# Altium project Shadowfang_Proj.PrjPcb
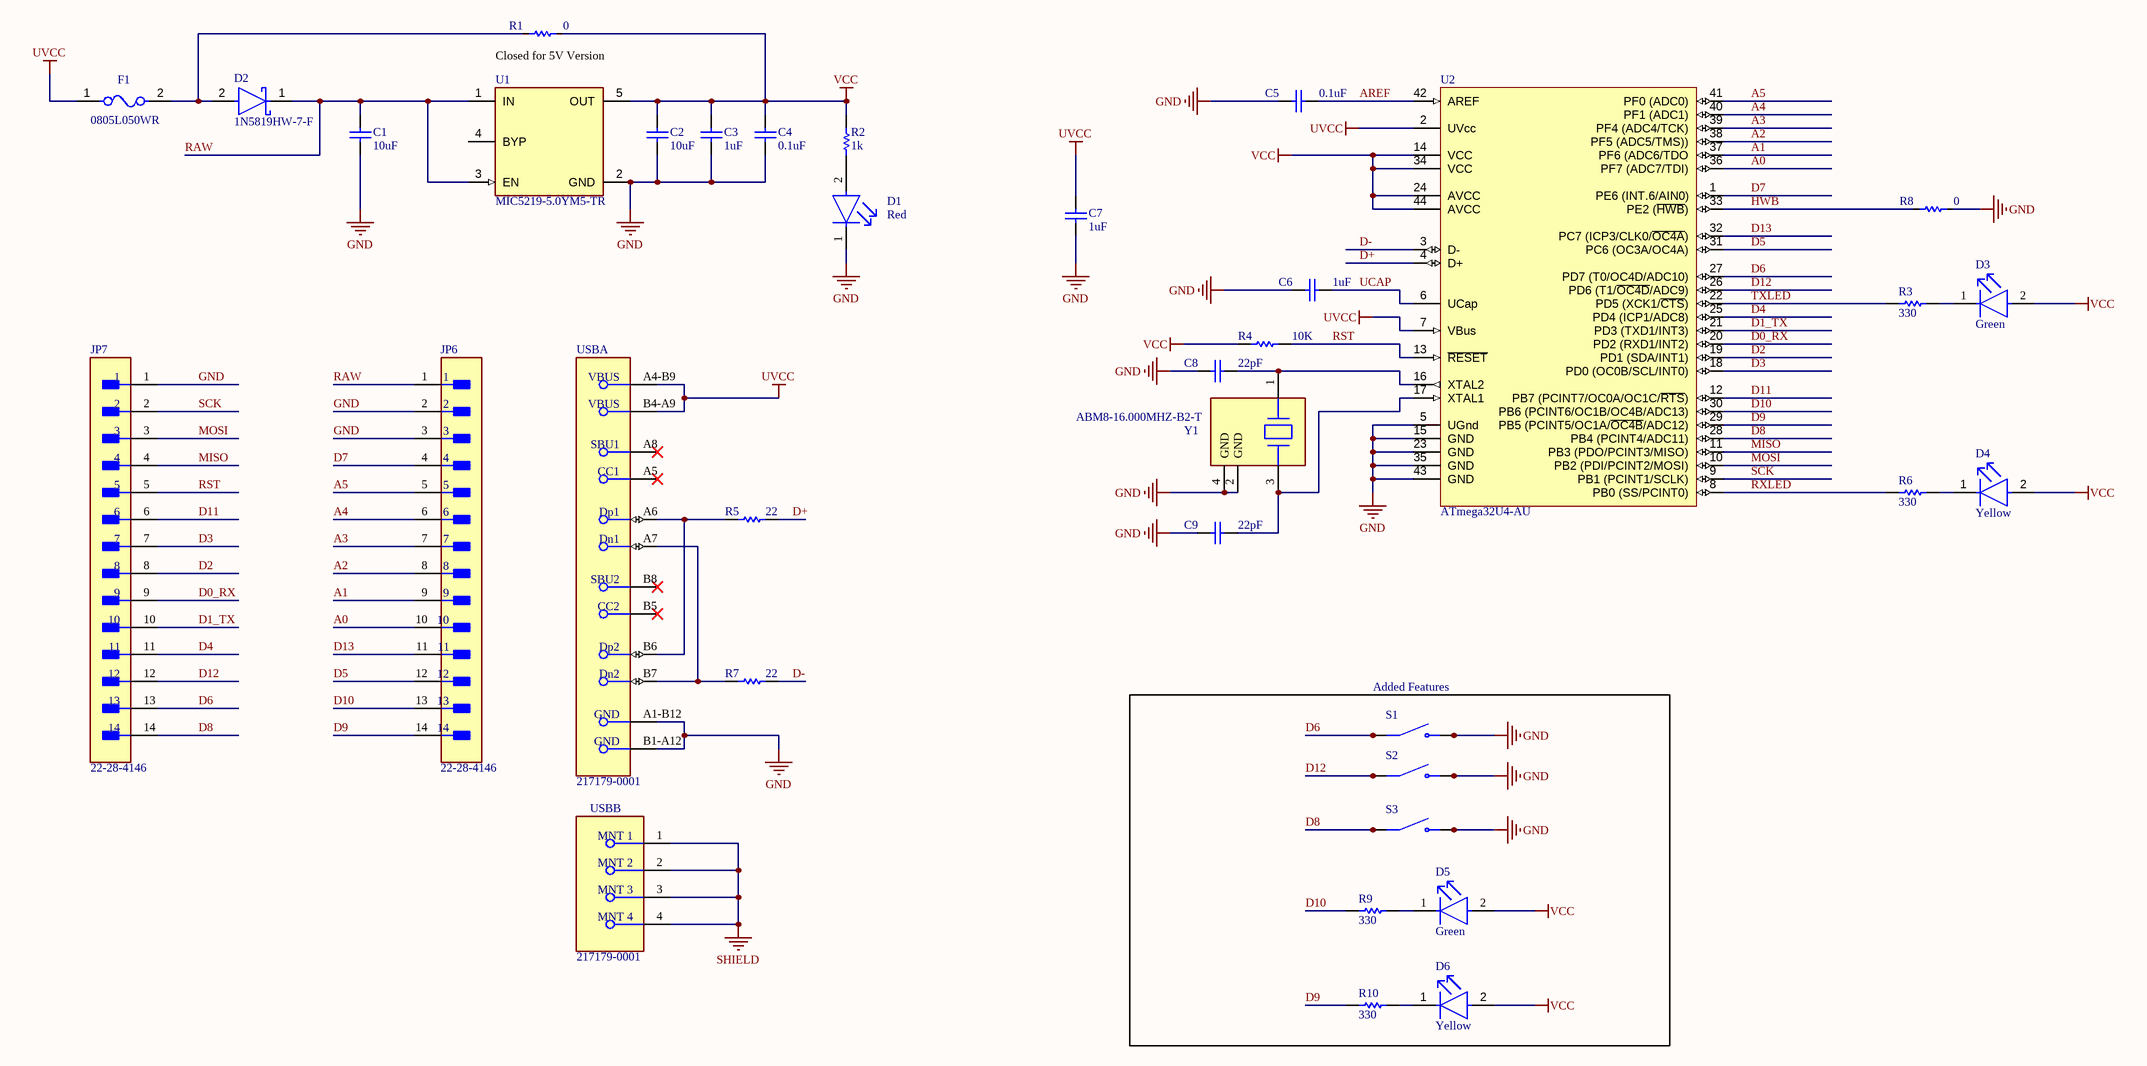
[diagram p0: ATMega32U4.SchDoc]
1 sheet, 35 parts. Net scope: global (net labels, ports and power ports of the same name join across sheets).
Board files: PCB1.PcbDoc, PCB_PANEL.PcbDoc

## Sheet ATMega32U4.SchDoc
size 863 x 558 mm; SheetNumber: 1; SheetTotal: 1

### Parts
C1  Capacitance: 10uF  [CAPC1608X09L]  (hidden comment: CAP GENERIC 0603)
C2  Capacitance: 10uF  [CAPC1608X09L]  (hidden comment: CAP GENERIC 0603)
C3  Capacitance: 1uF  [CAPC1608X09L]  (hidden comment: CAP GENERIC 0603)
C4  Capacitance: 0.1uF  [CAPC1608X09L]  (hidden comment: CAP GENERIC 0603)
C5  Capacitance: 0.1uF  [CAPC1608X09L]  (hidden comment: CAP GENERIC 0603)
C6  Capacitance: 1uF  [CAPC1608X09L]  (hidden comment: CAP GENERIC 0603)
C7  Capacitance: 1uF  [CAPC1608X09L]  (hidden comment: CAP GENERIC 0603)
C8  Capacitance: 22pF  [CAPC1608X09L]  (hidden comment: CAP GENERIC 0603)
C9  Capacitance: 22pF  [CAPC1608X09L]  (hidden comment: CAP GENERIC 0603)
D1  Red  [FP-LTST-C191KRKT-MFG]
D2  1N5819HW-7-F  [FP-SOD123-IPC_A]
D3  Green  [FP-LTST-C191KGKT-MFG]
D4  Yellow  [FP-LTST-C191KSKT-MFG]
D5  Green  [FP-LTST-C191KGKT-MFG]
D6  Yellow  [FP-LTST-C191KSKT-MFG]
F1  0805L050WR  [FP-0805L-MFG]
JP6  22-28-4146  [FP-22-28-4146-MFG]
JP7  22-28-4146  [FP-22-28-4146-MFG]
R1  0  [RES_0603]
R2  Resistance (Ohms): 1k  [RESC1608X06L]  (hidden comment: GENERIC 0603 RESISTOR)
R3  Resistance (Ohms): 330  [RESC1608X06L]  (hidden comment: GENERIC 0603 RESISTOR)
R4  Resistance (Ohms): 10K  [RESC1608X06L]  (hidden comment: GENERIC 0603 RESISTOR)
R5  Resistance (Ohms): 22  [RESC1608X06L]  (hidden comment: GENERIC 0603 RESISTOR)
R6  Resistance (Ohms): 330  [RESC1608X06L]  (hidden comment: GENERIC 0603 RESISTOR)
R7  Resistance (Ohms): 22  [RESC1608X06L]  (hidden comment: GENERIC 0603 RESISTOR)
R8  0  [RES_0603]
R9  Resistance (Ohms): 330  [RESC1608X06L]  (hidden comment: GENERIC 0603 RESISTOR)
R10  Resistance (Ohms): 330  [RESC1608X06L]  (hidden comment: GENERIC 0603 RESISTOR)
S1  PTS_647_SN50_SMTR2_LFS  [SW_PTS_647_SN50_SMTR2_LFS]  (value not drawn)
S2  PTS_647_SN50_SMTR2_LFS  [SW_PTS_647_SN50_SMTR2_LFS]  (value not drawn)
S3  PTS_647_SN50_SMTR2_LFS  [SW_PTS_647_SN50_SMTR2_LFS]  (value not drawn)
U1  MIC5219-5.0YM5-TR  [FP-SOT23-5LD-PL-1-MFG]
U2  ATmega32U4-AU  [44ML_M]
USB  217179-0001  [FP-2171790001-MFG]  (parts A,B of 2)
Y1  ABM8-16.000MHZ-B2-T  [FP-ABM8-MFG]

### Blocks framed on the sheet
Added Features: D5 D6 R9 R10 S1-S3

### Nets
GND: C1.1 C2.1 C3.1 C4.1 C5.1 C6.1 C7.1 C8.1 C9.1 D1.1(C) JP6.2 JP6.3 JP7.1 R8.2 S1.1(NO) S1.2(NO) S2.1(NO) S2.2(NO) S3.1(NO) S3.2(NO) U1.2(GND) U2.5(UGnd) U2.15(GND) U2.23(GND) U2.35(GND) U2.43(GND) USB.A1-B12(GND) USB.B1-A12(GND) Y1.2(GND) Y1.4(GND)
SHIELD: USB.1(MNT_1) USB.2(MNT_2) USB.3(MNT_3) USB.4(MNT_4)
UVCC: C7.2 F1.1 U2.2(UVcc) U2.7(VBus) USB.A4-B9(VBUS) USB.B4-A9(VBUS)
VCC: C2.2 C3.2 C4.2 D3.2(A) D4.2(A) D5.2(A) D6.2(A) R1.2 R2.2 R4.1 U1.5(OUT) U2.14(VCC) U2.24(AVCC) U2.34(VCC) U2.44(AVCC)
A0: JP6.10 U2.36(PF7_(ADC7/TDI))
A1: JP6.9 U2.37(PF6_(ADC6/TDO)
A2: JP6.8 U2.38(PF5_(ADC5/TMS)))
A3: JP6.7 U2.39(PF4_(ADC4/TCK))
A4: JP6.6 U2.40(PF1_(ADC1))
A5: JP6.5 U2.41(PF0_(ADC0))
AREF: C5.2 U2.42(AREF)
D0_RX: JP7.9 U2.20(PD2_(RXD1/INT2))
D1_TX: JP7.10 U2.21(PD3_(TXD1/INT3))
D2: JP7.8 U2.19(PD1_(SDA/INT1))
D3: JP7.7 U2.18(PD0_(OC0B/SCL/INT0))
D4: JP7.11 U2.25(PD4_(ICP1/ADC8))
D5: JP6.12 U2.31(PC6_(OC3A/OC4A))
D6: JP7.13 S1.3(COM) S1.4(COM) U2.27(PD7_(T0/OC4D/ADC10))
D7: JP6.4 U2.1(PE6_(INT.6/AIN0))
D8: JP7.14 S3.3(COM) S3.4(COM) U2.28(PB4_(PCINT4/ADC11))
D9: JP6.14 R10.1 U2.29(PB5_(PCINT5/OC1A/~{OC4B}/ADC12))
D10: JP6.13 R9.1 U2.30(PB6_(PCINT6/OC1B/OC4B/ADC13))
D11: JP7.6 U2.12(PB7_(PCINT7/OC0A/OC1C/~{RTS}))
D12: JP7.12 S2.3(COM) S2.4(COM) U2.26(PD6_(T1/~{OC4D}/ADC9))
D13: JP6.11 U2.32(PC7_(ICP3/CLK0/~{OC4A}))
D+: R5.2 U2.4(D+)
D-: R7.2 U2.3(D-)
HWB: R8.1 U2.33(PE2_(~{HWB}))
MISO: JP7.4 U2.11(PB3_(PDO/PCINT3/MISO))
MOSI: JP7.3 U2.10(PB2_(PDI/PCINT2/MOSI))
RAW: C1.2 D2.1(C) JP6.1 U1.1(IN) U1.3(EN)
RST: JP7.5 R4.2 U2.13(~{RESET})
RXLED: R6.1 U2.8(PB0_(SS/PCINT0))
SCK: JP7.2 U2.9(PB1_(PCINT1/SCLK))
TXLED: R3.1 U2.22(PD5_(XCK1/~{CTS}))
UCAP: C6.2 U2.6(UCap)
NetC8_2: C8.2 U2.16(XTAL2) Y1.1
NetC9_2: C9.2 U2.17(XTAL1) Y1.3
NetD1_2: D1.2(A) R2.1
NetD2_2: D2.2(A) F1.2 R1.1
NetD3_1: D3.1(C) R3.2
NetD4_1: D4.1(C) R6.2
NetD5_1: D5.1(C) R9.2
NetD6_1: D6.1(C) R10.2
NetR5_1: R5.1 USB.A6(Dp1) USB.B6(Dp2)
NetR7_1: R7.1 USB.A7(Dn1) USB.B7(Dn2)

Not connected (* = marked no-connect by the designer): U1 4(BYP); USB A5(CC1)* A8(SBU1)* B5(CC2)* B8(SBU2)*

### Notes on the sheet
- (near R1) Closed for 5V Version
- DWG. NO.
- REV.
- SHT.
- REVISION
- DESCRIPTION
- DATE
- APPROVED
- THIS DOCUMENT AND THE DATA DISCLOSED HEREIN OR HEREWITH IS THE PROPERTY OF ALTIUM LIMITED AND MAY BE FREELY DISTRIBUTED IN WHOLE. NO RIGHTS ARE RESERVED OR EXPRESS OR IMPLIED WARANTEE GIVEN.
- ENG:
- DSN:
- APPROVALS
- PROJECT
- DOCUMENT REVISION:
- DESIGN ITEM:
- CHK:
- BOM:
- REFERENCE DOCUMENTS
- PROJECT REVISION:
- TITLE
- FAB DWG:
- PCB DWG:
- ASSY DWG:
- SCALE:
- SIZE
- D
- CAGE CODE
- FILE NAME
- DWG NO.
- SHEET
- OF
- REV

### Library data of the parts
C1 C2 = CAP0603: Manufacturer Part Number: GRM188R61C106MAALD; Tolerance: *; Voltage (Rated): *; Temperature Coefficient: *; Ratings: *; Operating Temperature: *
C3 C6 C7 = CAP0603: Manufacturer Part Number: GCM188R71E105KA64D; Tolerance: *; Voltage (Rated): *; Temperature Coefficient: *; Ratings: *; Operating Temperature: *
C4 C5 = CAP0603: Manufacturer Part Number: GCM188R71H104KA57D; Tolerance: *; Voltage (Rated): *; Temperature Coefficient: *; Ratings: *; Operating Temperature: *
C8 C9 = CAP0603: Manufacturer Part Number: GCM1885C2A220FA16D; Tolerance: *; Voltage (Rated): *; Temperature Coefficient: *; Ratings: *; Operating Temperature: *
D1 = CMP-2000-05199-2: NexarPartId: 549908; Manufacturer: Vishay Lite-On; Manufacturer Part Number: LTST-C191KRKT; Lens Transparency: Clear; Luminous Intensity: 54mcd; Current: 2A; Forward Current: 20mA; Number of Elements: 1; Power Rating: 75mW; Lens Color: Colorless; Wavelength: 639nm; Viewing Angle: 130°; Voltage: 2V; Dominant Wavelength: 631nm; Reverse Voltage: 5V; Shape: Rectangular; Optoelectronic Device Type: SINGLE COLOR LED; Overall Height: 0.55mm; Illumination Color: Red; Height: 550µm; Length: 1.6mm; Number of Pins: 2; Packaging: Tape and Reel; Mount: Surface Mount; Case Code (Metric): 1608; Radiation Hardening: No; Case Code (Imperial): 0603; Test Current: 20mA; Number of LEDs: 1; Schedule B: 8541402000, 8541402000; Lead Free: Lead Free; Power Dissipation: 75mW; RoHS: Compliant; Forward Voltage: 2V; Lens Style: Clear; Color: Red; Max Operating Temperature: 85°C; Depth: 800µm; Width: 800µm; Min Operating Temperature: -55°C; Case/Package: 0603; Supplier: Digikey; Supplier Part Number: 160-1447-1-ND; Category: LEDs; Stock: 867088; Pricing: 1=0.15, 10=0.1, 100=0.0687, 500=0.05446, 1000=0.0497, 2000=0.04563, 5000=0.04114, 10000=0.03833, 15000=0.03689, 25000=0.03525, 35000=0.03428, 50000=0.03333, 125000=0.03123, 250000=0.02992 (USD); Mounting Technology: Surface Mount; Pins: 2; Color@wavelength: Red; Terminal Finish: Tin; JESD-609 Code: e3; Luminous Intensity-Nom: 54mcd; Channels: 1; Reverse Voltage-Max: 5V; Size: 1.1mm; Terminal Pitch: 1.5mm; Reach SVHC Compliant: Yes; RoHS Compliant: Yes; ComponentLink1URL: https://datasheet.ciiva.com:443/pdfs/VipMasterIC/IC/LITE/LITE-S-A0003156012/LITE-S-A0003156012-1.pdf?src-supplier=IHS+Markit; ComponentLink1Description: https://datasheet.ciiva.com:443/pdfs/VipMasterIC/IC/LITE/LITE-S-A0003156012/LITE-S-A0003156012-1.pdf?src-supplier=IHS+Markit; ComponentLink2URL: https://datasheet.ciiva.com/16212/ltst-c191krkt-16212419.pdf?src-supplier=Future+Electronics; ComponentLink2Description: https://datasheet.ciiva.com/16212/ltst-c191krkt-16212419.pdf?src-supplier=Future+Electronics; ComponentLink3URL: https://datasheet.ciiva.com/12400/lite-on-ltst-c191krkt-190135-12400910.pdf?src-supplier=Mouser; ComponentLink3Description: https://datasheet.ciiva.com/12400/lite-on-ltst-c191krkt-190135-12400910.pdf?src-supplier=Mouser; ComponentLink4URL: https://datasheet.ciiva.com/11773/0900766b80dc02b2-11773601.pdf?src-supplier=Rs; ComponentLink4Description: https://datasheet.ciiva.com/11773/0900766b80dc02b2-11773601.pdf?src-supplier=Rs; ComponentLink5URL: https://datasheet.ciiva.com/15117/getdatasheetpartid-141922-15117737.pdf?src-supplier=Verical; ComponentLink5Description: https://datasheet.ciiva.com/15117/getdatasheetpartid-141922-15117737.pdf?src-supplier=Verical; ComponentLink6URL: https://datasheet.ciiva.com/2109/s-110-ltst-c191krkt-2109970.pdf?src-supplier=Digikey; ComponentLink6Description: https://datasheet.ciiva.com/2109/s-110-ltst-c191krkt-2109970.pdf?src-supplier=Digikey; ComponentLink7URL: https://datasheet.ciiva.com/2109/s-110-ltst-c191krkt-2109971.pdf?src-supplier=Digikey; ComponentLink7Description: https://datasheet.ciiva.com/2109/s-110-ltst-c191krkt-2109971.pdf?src-supplier=Digikey; ComponentLink8URL: https://datasheet.ciiva.com/2109/s-110-ltst-c191krkt-2109972.pdf?src-supplier=Digikey; ComponentLink8Description: https://datasheet.ciiva.com/2109/s-110-ltst-c191krkt-2109972.pdf?src-supplier=Digikey
D2 = CMP-0303-00003-3: DIODE SCHOTTKY 40V 1A SOD123; Manufacturer: Diodes; Forward Voltage: 450mV; Capacitance: 110pF; Max Forward Surge Current (Ifsm): 25A; Peak Reverse Current: 50uA; Polarity: Standard; Element Configuration: Single; Max Power Dissipation: 450mW; Diode Element Material: SILICON; Package Body Material: Plastic; Diode Type: RECTIFIER; Number of Elements: 1; Time @ Peak Reflow Temperature-Max (s): 40s; Qualification Status: Not Qualified; Min Operating Temperature: -65°C; Package Quantity: 3000; Contact Plating: Tin; Weight: 0.000353oz; Max Repetitive Reverse Voltage (Vrrm): 40V; Max Reverse Voltage (DC): 40V; Height: 1.25mm; Average Rectified Current: 1A; Width: 1.7mm; Case/Package: SOD-123-2; Lead Free: Lead Free; Max Operating Temperature: 125°C; Current Rating: 1A; Termination: SMD/SMT; Forward Current: 1A; Radiation Hardening: No; Number of Pins: 2; Length: 2.85mm; Voltage Rating (DC): 40V; REACH SVHC: No SVHC; Peak Non-Repetitive Surge Current: 25A; Packaging: Tape and Reel; Output Current: 1A; Supplier: Digikey; Supplier Part Number: 1N5819HW-FDICT-ND; Manufacturer Part Number: 1N5819HW-7-F; RoHS: Yes; Category: Schottky Diodes; Stock: 233752; Pricing: 1=0.23, 10=0.143, 100=0.1103, 500=0.09626, 1000=0.08516, 3000=0.05656, 6000=0.0532, 9000=0.05304, 15000=0.03424 (USD); Pins: 2; Package Shape: Rectangular; Terminal Finish: Tin; Non-rep Pk Forward Current-Max: 25A; Max Output current: 1A; Package Style: SMALL OUTLINEMeter; Rep Pk Reverse Voltage-Max: 40V; Surface Mount: Yes; Terminal Form: Gull Wing; Terminal Position: DUAL; JESD-609 Code: e3; JESD-30 Code: R-PDSO-G2; Peak Reflow Temperature (Cel): 260°C; Moisture Sensitivity Level: 1; Technology: SCHOTTKY; Reach SVHC Compliant: Yes; RoHS Compliant: Yes; ComponentLink1URL: https://datasheet.ciiva.com:443/pdfs/VipMasterIC/IC/DIOD/DIOD-S-A0009689747/DIOD-S-A0009691035-1.pdf?src-supplier=IHS+Markit; ComponentLink1Description: https://datasheet.ciiva.com:443/pdfs/VipMasterIC/IC/DIOD/DIOD-S-A0009689747/DIOD-S-A0009691035-1.pdf?src-supplier=IHS+Markit
D3 D5 = CMP-2000-05198-4: LED GREEN CLEAR SMD; NexarPartId: 549907; Manufacturer: Vishay Lite-On; Manufacturer Part Number: LTST-C191KGKT; Forward Voltage: 2V; Viewing Angle: 130°; Power Rating: 75mW; Number of LEDs: 1; Luminous Intensity: 35mcd; Forward Current: 20mA; Dominant Wavelength: 571nm; Lens Color: Clear, Colorless; Reverse Voltage: 5V; Wavelength: 574nm; Shape: Rectangular; Optoelectronic Device Type: SINGLE COLOR LED; Overall Height: 0.55mm; Number of Pins: 2; Lens Transparency: Clear; Packaging: Tape and Reel; Number of Elements: 1; Schedule B: 8541402000, 8541402000; Height: 550µm; Case/Package: 0603; Illumination Color: Green; Depth: 800µm; Max Operating Temperature: 85°C; RoHS: Compliant; Lens Style: Clear; Lead Free: Lead Free; Length: 1.6mm; Mount: Surface Mount; Test Current: 20mA; Width: 800µm; Case Code (Imperial): 0603; Min Operating Temperature: -55°C; Case Code (Metric): 1608; Radiation Hardening: No; Power Dissipation: 75mW; Color: Green; Supplier: Digikey; Supplier Part Number: 160-1446-1-ND; Stock: 1664852; Pricing: 1=0.15, 10=0.1, 100=0.0688, 500=0.05448, 1000=0.04972, 2000=0.04564, 5000=0.04116, 10000=0.03835, 15000=0.0369, 25000=0.03527, 35000=0.03429, 50000=0.03334, 125000=0.03124, 250000=0.02993 (USD); Mounting Technology: Surface Mount; Pins: 2; Color@wavelength: Green; Terminal Finish: Tin; Luminous Intensity-Nom: 35mcd; Channels: 1; JESD-609 Code: e3; Reverse Voltage-Max: 5V; Size: 1.1mm; Terminal Pitch: 1.5mm; Reach SVHC Compliant: Yes; RoHS Compliant: Yes; ComponentLink1URL: https://datasheet.ciiva.com:443/pdfs/VipMasterIC/IC/LITE/LITE-S-A0003156116/LITE-S-A0003156116-1.pdf?src-supplier=IHS+Markit; ComponentLink1Description: https://datasheet.ciiva.com:443/pdfs/VipMasterIC/IC/LITE/LITE-S-A0003156116/LITE-S-A0003156116-1.pdf?src-supplier=IHS+Markit; ComponentLink2URL: https://datasheet.ciiva.com/2109/ltst-c191kgkt-2109973.pdf?src-supplier=Digikey; ComponentLink2Description: https://datasheet.ciiva.com/2109/ltst-c191kgkt-2109973.pdf?src-supplier=Digikey
D4 D6 = CMP-22017-000025-1: LED YELLOW CLEAR SMD; Manufacturer: Vishay Lite-On; Manufacturer Part Number: LTST-C191KSKT; Dominant Wavelength: 597nm; Power Rating: 75mW; Number of LEDs: 1; Lens Style: Diffused; Forward Current: 30mA; Test Current: 20mA; Forward Voltage: 2.4V; Wavelength: 588nm; Viewing Angle: 130°; Lens Color: Colorless; Reverse Voltage: 5V; Luminous Intensity: 180mcd; Shape: Rectangular; Optoelectronic Device Type: SINGLE COLOR LED; Luminous Intensity-Nom: 104mcd; Overall Height: 0.55mm; Case Code (Imperial): 0603; Width: 0.8mm; Power Dissipation: 75mW; Length: 1.6mm; Illumination Color: Yellow; Number of Pins: 2; Case Code (Metric): 1608; Mount: Surface Mount; Number of Elements: 1; Height: 0.55mm; Lens Transparency: Clear; Depth: 0.8mm; Min Operating Temperature: -55°C; Case/Package: 0603; Radiation Hardening: No; Max Operating Temperature: 85°C; Package Quantity: 1; Packaging: Tape and Reel; Lead Free: Lead Free; Color: Yellow; Supplier: Digikey; Supplier Part Number: 160-1448-1-ND; RoHS: Yes; Category: LEDs; Stock: 620459; Pricing: 1=0.15, 10=0.105, 100=0.0723, 500=0.05736, 1000=0.05238, 2000=0.04813, 5000=0.04344, 10000=0.0405, 15000=0.03899, 25000=0.03728, 35000=0.03627, 50000=0.03527, 125000=0.03308, 250000=0.03171 (USD); Mounting Technology: Surface Mount; Pins: 2; Color@wavelength: Yellow; Terminal Finish: Tin; JESD-609 Code: e3; Channels: 1; Reverse Voltage-Max: 5V; Size: 1.1mm; Terminal Pitch: 1.5mm; Reach SVHC Compliant: Yes; RoHS Compliant: Yes; ComponentLink1URL: https://datasheet.ciiva.com:443/pdfs/VipMasterIC/IC/LITE/LITE-S-A0008870965/LITE-S-A0008870965-1.pdf?src-supplier=IHS+Markit; ComponentLink1Description: https://datasheet.ciiva.com:443/pdfs/VipMasterIC/IC/LITE/LITE-S-A0008870965/LITE-S-A0008870965-1.pdf?src-supplier=IHS+Markit; ComponentLink2URL: https://datasheet.ciiva.com/12400/lite-on-ltst-c191kskt-190097-12400797.pdf?src-supplier=Mouser; ComponentLink2Description: https://datasheet.ciiva.com/12400/lite-on-ltst-c191kskt-190097-12400797.pdf?src-supplier=Mouser; ComponentLink3URL: https://datasheet.ciiva.com/11773/0900766b80dc02b3-11773512.pdf?src-supplier=Rs; ComponentLink3Description: https://datasheet.ciiva.com/11773/0900766b80dc02b3-11773512.pdf?src-supplier=Rs; ComponentLink4URL: https://datasheet.ciiva.com/16213/lite-on20ltst-c191kskt-16213725.pdf?src-supplier=Future+Electronics; ComponentLink4Description: https://datasheet.ciiva.com/16213/lite-on20ltst-c191kskt-16213725.pdf?src-supplier=Future+Electronics; ComponentLink5URL: https://datasheet.ciiva.com/15117/getdatasheetpartid-141495-15117732.pdf?src-supplier=Verical; ComponentLink5Description: https://datasheet.ciiva.com/15117/getdatasheetpartid-141495-15117732.pdf?src-supplier=Verical; ComponentLink6URL: https://datasheet.ciiva.com/2109/s-110-ltst-c191kskt-2109984.pdf?src-supplier=Digikey; ComponentLink6Description: https://datasheet.ciiva.com/2109/s-110-ltst-c191kskt-2109984.pdf?src-supplier=Digikey
F1 = CMP-08606-000023-1: PTC RESET FUSE 6V 500MA 0805; Manufacturer: Littelfuse Inc.; Current Rating: 100A; Hold Current: 0.5A; Value: 0.15-0.85Ω; Trip Time: 0.1s; Trip Current: 1A; Device Class L2: PTC Resettable Fuses; Manufacturer Part Number: 0805L050WR; Digikey Description: PTC RESET FUSE 6V 500MA 0805; ComponentLink2URL: https://www.littelfuse.com/~/media/electronics/datasheets/resettable_ptcs/littelfuse_ptc_0805l_datasheet.pdf.pdf; Package: 0805L; RoHS: TRUE; Temperature Range Low: -40°C; Octopart: https://octopart.com/0805l050wr-littelfuse-673858; Resistance: 0.15-0.85Ω; ComponentLink2Description: Datasheet; Category: Fuse; Height: 1.25mm; Mouser Description: PTC Resettable Fuse 0.5A(hold) 1A(trip) 6VDC 100A 0.5W 0.1s 0.15Ohm SMD Solder Pad 0805 T/R; Ambient Temperature Range High: +85°C; Automotive: No; Device Class L3: unset; Lead Free: Yes; Temperature: -40°C to +85°C; Voltage Rating: 6V; Ambient Temperature Range Low: -40°C; Temperature Range High: +85°C; Device Class L1: Circuit Protection
JP6 JP7 = 22-28-4146: CONN HEADER VERT 14POS 2.54MM; Manufacturer: Molex; Manufacturer Series: 42375; Number of Contacts: 14; Voltage Rating: 250V; Glow Wire Compliant: Non-compliant; Connector Type: Male Pin; Pitch: 0.1inch; Current Rating: 4A; Gender: Male; Option: General Purpose; Body/Shell Style: RECEPTACLE; Contact Pattern: RECTANGULAR; Filter Feature: No; Number of Rows Loaded: 1; Contact Style: SQ PIN-SKT; Contact Resistance: 10mR; Mating Information: MULTIPLE MATING PARTS AVAILABLE; Insertion Force-Max: 4.8928N; Insulation Resistance: 1GR; Withdrawl Force-Min: 0.556N; Body Breadth: 0.098inch; Body Length: 1.4inch; Body Depth: 0.09inch; Plating Thickness: 100uin; Mounting Option 1: LOCKING; Reference Standard: UL; Reliability: COMMERCIAL; RoHS Compliant: Yes; Packaging: Bulk; Housing Material: Thermoplastic; Package Quantity: 1; Number of Positions: 14; Color: Black; Length: 35.6mm; Width: 2.49mm; Termination: Solder; Contact Mating Length: 0.24inch; Series: KK® 42375; Mount: Through Hole; Contact Gender: Male; Number of Circuits: 14; Orientation: Vertical; Contact Type: Male Pin; Contact Plating: Gold; Lead Free: Lead Free; Number of Rows: 1; Height: 2.29mm; Contact Material: Brass; Housing Color: Black; Supplier: Digikey; Supplier Part Number: WM24210-ND; Manufacturer Part Number: 22-28-4146; RoHS: Yes; Category: Headers and Wire Housings; Stock: 4272; Pricing: 1=0.91, 10=0.772, 100=0.6562, 500=0.58568, 1000=0.55772, 5000=0.49786, 10000=0.47411 (USD); Mounting Technology: Board; Contact Finish - Mating: NOT SPECIFIED; Insulation Material: Nylon; Contact Finish - Termination: TIN OVER NICKEL; Insulation Color: Black; Mixed Contacts: No; Mounting Style: STRAIGHT; Number Of Connectors: 1; Number Of PCB Rows: 1; PCB Contact Pattern: RECTANGULAR; Mating Contact Pitch: 0.1inch; Terminal Pitch: 2.54mm; Terminal Length: 0.125inch; Flammability Rating: UL94 V-0; DIN Conformance: No; IEC Conformance: No; MIL Conformance: No; Reach SVHC Compliant: Yes; ComponentLink1URL: https://datasheet.ciiva.com:443/pdfs/VipMasterIC/IC/MOLE/MOLE-S-A0003536348/MOLE-S-A0003536348-1.pdf?src-supplier=IHS+Markit; ComponentLink1Description: https://datasheet.ciiva.com:443/pdfs/VipMasterIC/IC/MOLE/MOLE-S-A0003536348/MOLE-S-A0003536348-1.pdf?src-supplier=IHS+Markit; ComponentLink2URL: https://datasheet.ciiva.com/6814/022284363-sd-6814049.pdf?src-supplier=Digikey; ComponentLink2Description: https://datasheet.ciiva.com/6814/022284363-sd-6814049.pdf?src-supplier=Digikey; ComponentLink3URL: https://datasheet.ciiva.com/10079/0022284146-pcb-headers-10079164.pdf?src-supplier=Avnet; ComponentLink3Description: https://datasheet.ciiva.com/10079/0022284146-pcb-headers-10079164.pdf?src-supplier=Avnet; ComponentLink4URL: https://datasheet.ciiva.com/5163/0022284146-pcb-headers-228333-5163807.pdf?src-supplier=Mouser; ComponentLink4Description: https://datasheet.ciiva.com/5163/0022284146-pcb-headers-228333-5163807.pdf?src-supplier=Mouser
R1 R8 = CRCW06030000Z0EA: Metal Glaze/thick Film, 0.1W, 0ohm, Surface Mount, 0603; Manufacturer: Vishay; Power: 100mW; Rated Temperature: 70°C; Package Height: 0.45mm; Package Length: 1.55mm; Package Width: 0.85mm; Reference Standard: AEC-Q200; Supplier: Digikey; Supplier Part Number: 541-0.0GCT-ND; Manufacturer Part Number: CRCW06030000Z0EA; RoHS: Yes; Category: Chip SMD Resistors; Stock: 1285178; Pricing: 1=0.1, 10=0.028, 25=0.0216, 50=0.0164, 100=0.0115, 250=0.00928, 500=0.00742, 1000=0.00546, 5000=0.00501, 10000=0.00434, 15000=0.004, 25000=0.00362, 35000=0.00339, 50000=0.00318, 125000=0.0027, 250000=0.0025 (USD); Mounting Technology: Surface Mount; Pins: 2; Package Shape: Rectangular; Case/Package: 0603; Terminal Finish: Nickel; Min Operating Temperature: -55°C; Max Operating Temperature: 155°C; JESD-609 Code: e3; Resistor Type: FIXED RESISTOR; Construction: Chip; Packaging: Tape and Reel; Technology: METAL GLAZE/THICK FILM; Termination: Wraparound; Reach SVHC Compliant: Yes; RoHS Compliant: Yes; ComponentLink1URL: https://datasheet.ciiva.com:443/pdfs/VipMasterIC/IC/VISH/VISH-S-A0007266705/VISH-S-A0007266705-1.pdf?src-supplier=IHS+Markit; ComponentLink1Description: https://datasheet.ciiva.com:443/pdfs/VipMasterIC/IC/VISH/VISH-S-A0007266705/VISH-S-A0007266705-1.pdf?src-supplier=IHS+Markit; ComponentLink2URL: http://www.farnell.com/datasheets/2310790.pdf?src-supplier=Farnell; ComponentLink2Description: http://www.farnell.com/datasheets/2310790.pdf?src-supplier=Farnell; ComponentLink3URL: http://www.farnell.com/datasheets/2310790.pdf?src-supplier=Element14; ComponentLink3Description: http://www.farnell.com/datasheets/2310790.pdf?src-supplier=Element14; ComponentLink4URL: http://datasheet.octopart.com/CRCW06030000Z0EA-Vishay-datasheet-14722531.pdf?src-supplier=Avnet; ComponentLink4Description: http://datasheet.octopart.com/CRCW06030000Z0EA-Vishay-datasheet-14722531.pdf?src-supplier=Avnet; ComponentLink5URL: https://datasheet.octopart.com/CRCW06030000Z0EA-Vishay-datasheet-14722531.pdf?src-supplier=Newark; ComponentLink5Description: https://datasheet.octopart.com/CRCW06030000Z0EA-Vishay-datasheet-14722531.pdf?src-supplier=Newark; ComponentLink6URL: http://datasheet.octopart.com/CRCW06030000Z0EA-Vishay-datasheet-14722531.pdf?src-supplier=Mouser; ComponentLink6Description: http://datasheet.octopart.com/CRCW06030000Z0EA-Vishay-datasheet-14722531.pdf?src-supplier=Mouser; ComponentLink7URL: https://datasheet.octopart.com/CRCW06030000Z0EA-Vishay-datasheet-5300368.pdf?src-supplier=Future+Electronics; ComponentLink7Description: https://datasheet.octopart.com/CRCW06030000Z0EA-Vishay-datasheet-5300368.pdf?src-supplier=Future+Electronics; ComponentLink8URL: http://datasheet.octopart.com/CRCW06030000Z0EA-Vishay-datasheet-14722531.pdf?src-supplier=Distrelec; ComponentLink8Description: http://datasheet.octopart.com/CRCW06030000Z0EA-Vishay-datasheet-14722531.pdf?src-supplier=Distrelec; ComponentLink9URL: http://www.vishay.com/docs/20035/dcrcwe3.pdf?src-supplier=Digikey; ComponentLink9Description: http://www.vishay.com/docs/20035/dcrcwe3.pdf?src-supplier=Digikey; ComponentLink10URL: https://datasheet.octopart.com/CRCW06030000Z0EA-Vishay-datasheet-62317933.pdf?src-supplier=Element14; ComponentLink10Description: https://datasheet.octopart.com/CRCW06030000Z0EA-Vishay-datasheet-62317933.pdf?src-supplier=Element14; ComponentLink11URL: http://www.farnell.com/datasheets/2310790.pdf?src-supplier=Newark; ComponentLink11Description: http://www.farnell.com/datasheets/2310790.pdf?src-supplier=Newark; ComponentLink12URL: http://datasheet.octopart.com/CRCW06030000Z0EA-Vishay-datasheet-14722531.pdf?src-supplier=Freelance+Electronics; ComponentLink12Description: http://datasheet.octopart.com/CRCW06030000Z0EA-Vishay-datasheet-14722531.pdf?src-supplier=Freelance+Electronics; ComponentLink13URL: http://datasheet.octopart.com/CRCW06030000Z0EA-Vishay-datasheet-14722531.pdf?src-supplier=Quest; ComponentLink13Description: http://datasheet.octopart.com/CRCW06030000Z0EA-Vishay-datasheet-14722531.pdf?src-supplier=Quest; ComponentLink14URL: http://datasheet.octopart.com/CRCW06030000Z0EA-Vishay-datasheet-14722531.pdf?src-supplier=Component+Sense; ComponentLink14Description: http://datasheet.octopart.com/CRCW06030000Z0EA-Vishay-datasheet-14722531.pdf?src-supplier=Component+Sense; ComponentLink15URL: http://datasheet.octopart.com/CRCW06030000Z0EA-Vishay-datasheet-14722531.pdf?src-supplier=New+Yorker+Electronics; ComponentLink15Description: http://datasheet.octopart.com/CRCW06030000Z0EA-Vishay-datasheet-14722531.pdf?src-supplier=New+Yorker+Electronics; Resistance: 0
R2 = RES0603: Manufacturer Part Number: CRCW06031K00FKEAHP; Tolerance: *; Power (Watts): *; Temperature Coefficient: *; Ratings: *; Operating Temperature: *
R3 R6 R9 R10 = RES0603: Manufacturer Part Number: CRCW0603330RFKEAHP; Tolerance: *; Power (Watts): *; Temperature Coefficient: *; Ratings: *; Operating Temperature: *
R4 = RES0603: Manufacturer Part Number: CRCW060310K0FKEAHP; Tolerance: *; Power (Watts): *; Temperature Coefficient: *; Ratings: *; Operating Temperature: *
R5 R7 = RES0603: Manufacturer Part Number: CRCW060322R0JNEAHP; Tolerance: *; Power (Watts): *; Temperature Coefficient: *; Ratings: *; Operating Temperature: *
S1-S3 = PTS_647_SN50_SMTR2_LFS: Tactile Switch SPST-NO Top Actuated Surface Mount; Manufacturer Part Number: Y97KT23B0FAFP; MF: C&K; MP: PTS 647 SN50 SMTR2 LFS; SnapEDA_Link: https://www.snapeda.com/parts/PTS%20647%20SN50%20SMTR2%20LFS/C%2526K/view-part/?ref=snap; Package: None; Value: *; Check_prices: https://www.snapeda.com/parts/PTS%20647%20SN50%20SMTR2%20LFS/C%2526K/view-part/?ref=eda
U1 = CMP-06324-000019-1: IC REG LINEAR 5V 500MA SOT23-5; Manufacturer: Microchip Technology; Number Of Outputs: 1; Accuracy Percentage: 1%; Min Supply Voltage: 2.5V; Dropout Voltage: 350mV; Nominal Supply Current: 80-12000uA; Standoff Height: 0mm; Max Junction Temp: +125°C; Output Type: Fixed; Max Supply Voltage: 12V; ComponentLink2Description: Datasheet; Manufacturer Part Number: MIC5219-5.0YM5-TR; Category: IC; Height: 1.45mm; Temperature: -40°C to +125°C; Device Class L1: Integrated Circuits (ICs); Device Class L3: Voltage Regulators - Linear; Octopart: https://octopart.com/mic5219-5.0ym5-tr-microchip-66802269; Output Current: 500mA; Temperature Range Low: -40°C; Lead Free: Yes; Package: SOT23-5LD-PL-1; Automotive: No; Ambient Temperature Range High: +125°C; ComponentLink2URL: http://ww1.microchip.com/downloads/en/DeviceDoc/MIC5219-500mA-Peak-Output-LDO-Regulator-DS20006021A.pdf; Output Voltage: 5V; Temperature Range High: +125°C; Digikey Description: IC REG LINEAR 5V 500MA SOT23-5; Ambient Temperature Range Low: -40°C; RoHS: TRUE; Mouser Description: IC REG LINEAR 5V 500MA SOT23-5; Device Class L2: Power Management ICs
U2 = CMP-0095-00285-2: 8-bit AVR Microcontroller, 2.7-5.5V, 16MHz, 32KB Flash, 1KB EEPROM, 2.5KB SRAM, USB Controller, 44-pin TQFP, Industrial Grade (-40°C to 85°C), Ext Osc; Manufacturer: Microchip; Package Body Material: Plastic; Number of I/O Lines: 26; Package Equivalence Code: TQFP44,.47SQ,32; Power Supplies: 3/5; Max Supply Current: 15mA; Max Supply Voltage: 5.5V; Min Supply Voltage: 4.5V; Nominal Supply Voltage: 5V; Peripherals: POR,PWM,WDT; Interface: SPI,USB,USART; Qualification Status: Not Qualified; RevisionNote: DatasheetVersion updated. URLs added.; ComponentLink1Description: Manufacturer URL; PackageDescription: 44-Pin Plastic Thin Quad Flat Pack, 10 x 10 x 1.0 mm Body, 0.8 mm Pitch (TQFP); DatasheetVersion: revF, Nov-2010; ComponentLink2URL: http://www.atmel.com/dyn/resources/prod_documents/doc7766.pdf; ComponentLink1URL: http://www.atmel.com/; PackageReference: 44ML; ComponentLink2Description: ATmega16U4/32U4 Datasheet; PackageVersion: rev.G, Jul-2007; ComponentLink3URL: http://www.atmel.com/dyn/resources/prod_documents/7766S.pdf; ComponentLink3Description: ATmega16U4 ATmega32U4 Summary; MPN: ATmega32U4-AU; Supplier: Digikey; Supplier Part Number: ATMEGA32U4-AU-ND; Manufacturer Part Number: ATMEGA32U4-AU; RoHS: Yes; Stock: 9921; Pricing: 1=5.29, 25=4.84, 100=4.39 (USD); Case/Package: TQFP; Pins: 44; Package Shape: Square; Min Operating Temperature: -40°C; Max Operating Temperature: 85°C; Clock Frequency: 16MHz; JESD-30 Code: S-PQFP-G44; Surface Mount: Yes; Technology: CMOS; Terminal Form: Gull Wing; Terminal Position: QUAD; Length: 10mm; Width: 10mm; Height - Seated (Max): 1.2mm; Terminal Pitch: 0.8mm; RoHS Compliant: Yes; Reach SVHC Compliant: Yes; Temperature Grade: INDUSTRIAL; ComponentLink4URL: https://datasheet.ciiva.com:443/pdfs/VipMasterIC/IC/ATML/ATML-S-A0001723807/ATML-S-A0001723807-1.pdf?src-supplier=IHS+Markit; ComponentLink4Description: https://datasheet.ciiva.com:443/pdfs/VipMasterIC/IC/ATML/ATML-S-A0001723807/ATML-S-A0001723807-1.pdf?src-supplier=IHS+Markit; ComponentLink5URL: https://datasheet.ciiva.com/22651/1684411-22651233.pdf?src-supplier=Farnell; ComponentLink5Description: https://datasheet.ciiva.com/22651/1684411-22651233.pdf?src-supplier=Farnell; ComponentLink6URL: https://datasheet.ciiva.com/15122/getdatasheetpartid-116246-15122378.pdf?src-supplier=Verical; ComponentLink6Description: https://datasheet.ciiva.com/15122/getdatasheetpartid-116246-15122378.pdf?src-supplier=Verical; ComponentLink7URL: https://datasheet.ciiva.com/1157/1684411-1157762.pdf?src-supplier=Element14; ComponentLink7Description: https://datasheet.ciiva.com/1157/1684411-1157762.pdf?src-supplier=Element14
USB = CMP-04767-000028-2: CONN RCP USB2.0 TYP C 24P SMD RA; NexarPartId: 117190526; Manufacturer Part Number: 2171790001; Gender: Receptacle; Number of Contacts: 16; Current Rating: 1.25A; Voltage Rating: 30V; Min Operating Temperature: -40°C; USB Standard: USB 2.0; Height: 3.36mm; Contact Material: Gold, Nickel; Max Operating Temperature: 85°C
Y1 = CMP-27762-006167-1: Crystal 16MHz ±20ppm 18pF SMD-4 3.2mm x 2.5mm; Manufacturer: Abracon; Series Resistance: 70R; Frequency Stability: 50ppm; Crystal/Resonator Type: PARALLEL - FUNDAMENTAL; Operating Frequency-Nom: 160; Aging: 3 PPM/FIRST YEAR; Drive Level: 10uW; Tolerance: 20ppm; Number of Pins: 4; Max Operating Temperature: 70°C; Operating Frequency: 16 MHz; Height: 0.031inch; REACH SVHC: No SVHC; Frequency: 16MHz; Depth: 2.5mm; Package Quantity: 1000; Series: ABM8; Termination: SMD/SMT; Load Capacitance: 18pF; Frequency Tolerance: 20ppm; Min Operating Temperature: -20°C; Length: 3.2mm; ESR (Equivalent Series Resistance): 70R; Width: 2.5mm; Lead Free: Lead Free; Resistor Type: Ceramic; Radiation Hardening: No; Mount: Surface Mount; RoHS Compliant: Yes; Case/Package: CSMD; Packaging: Tape and Reel; Supplier: Digikey; Supplier Part Number: 535-9134-1-ND; Manufacturer Part Number: ABM8-16.000MHZ-B2-T; RoHS: Yes; Category: Crystals; Stock: 20075; Pricing: 1=0.68, 10=0.593, 25=0.5612, 50=0.538, 100=0.5157, 250=0.48772, 500=0.46754, 1000=0.34577 (USD); Mounting Technology: Surface Mount; Terminal Finish: Nickel; ESR: 70R; JESD-609 Code: e4; Reach SVHC Compliant: Yes; ComponentLink1URL: https://datasheet.ciiva.com:443/pdfs/VipMasterIC/IC/ABRC/ABRC-S-A0006116959/ABRC-S-A0006116959-1.pdf?src-supplier=IHS+Markit; ComponentLink1Description: https://datasheet.ciiva.com:443/pdfs/VipMasterIC/IC/ABRC/ABRC-S-A0006116959/ABRC-S-A0006116959-1.pdf?src-supplier=IHS+Markit; ComponentLink2URL: https://datasheet.ciiva.com/3175/abm8-3175964.pdf?src-supplier=Avnet; ComponentLink2Description: https://datasheet.ciiva.com/3175/abm8-3175964.pdf?src-supplier=Avnet; ComponentLink3URL: https://datasheet.ciiva.com/856/abm8-856355.pdf?src-supplier=Digikey; ComponentLink3Description: https://datasheet.ciiva.com/856/abm8-856355.pdf?src-supplier=Digikey; ComponentLink4URL: https://datasheet.ciiva.com/856/abm8-856356.pdf?src-supplier=Digikey; ComponentLink4Description: https://datasheet.ciiva.com/856/abm8-856356.pdf?src-supplier=Digikey; ComponentLink5URL: https://datasheet.ciiva.com/856/abm8-856357.pdf?src-supplier=Digikey; ComponentLink5Description: https://datasheet.ciiva.com/856/abm8-856357.pdf?src-supplier=Digikey; ComponentLink6URL: https://datasheet.ciiva.com/16416/abm8-16416886.pdf?src-supplier=Future+Electronics; ComponentLink6Description: https://datasheet.ciiva.com/16416/abm8-16416886.pdf?src-supplier=Future+Electronics